# Altium schematic sheet TopSheet.SchDoc
size A4; CompanyName: Zohm Control GmbH; Address1: Rittersbacher Straße 48c; Address2: 91126 Schwabach; Address3: GERMANY; DocumentNumber: 3; SheetNumber: 3; SheetTotal: 6; Website: www.zohm-control.com
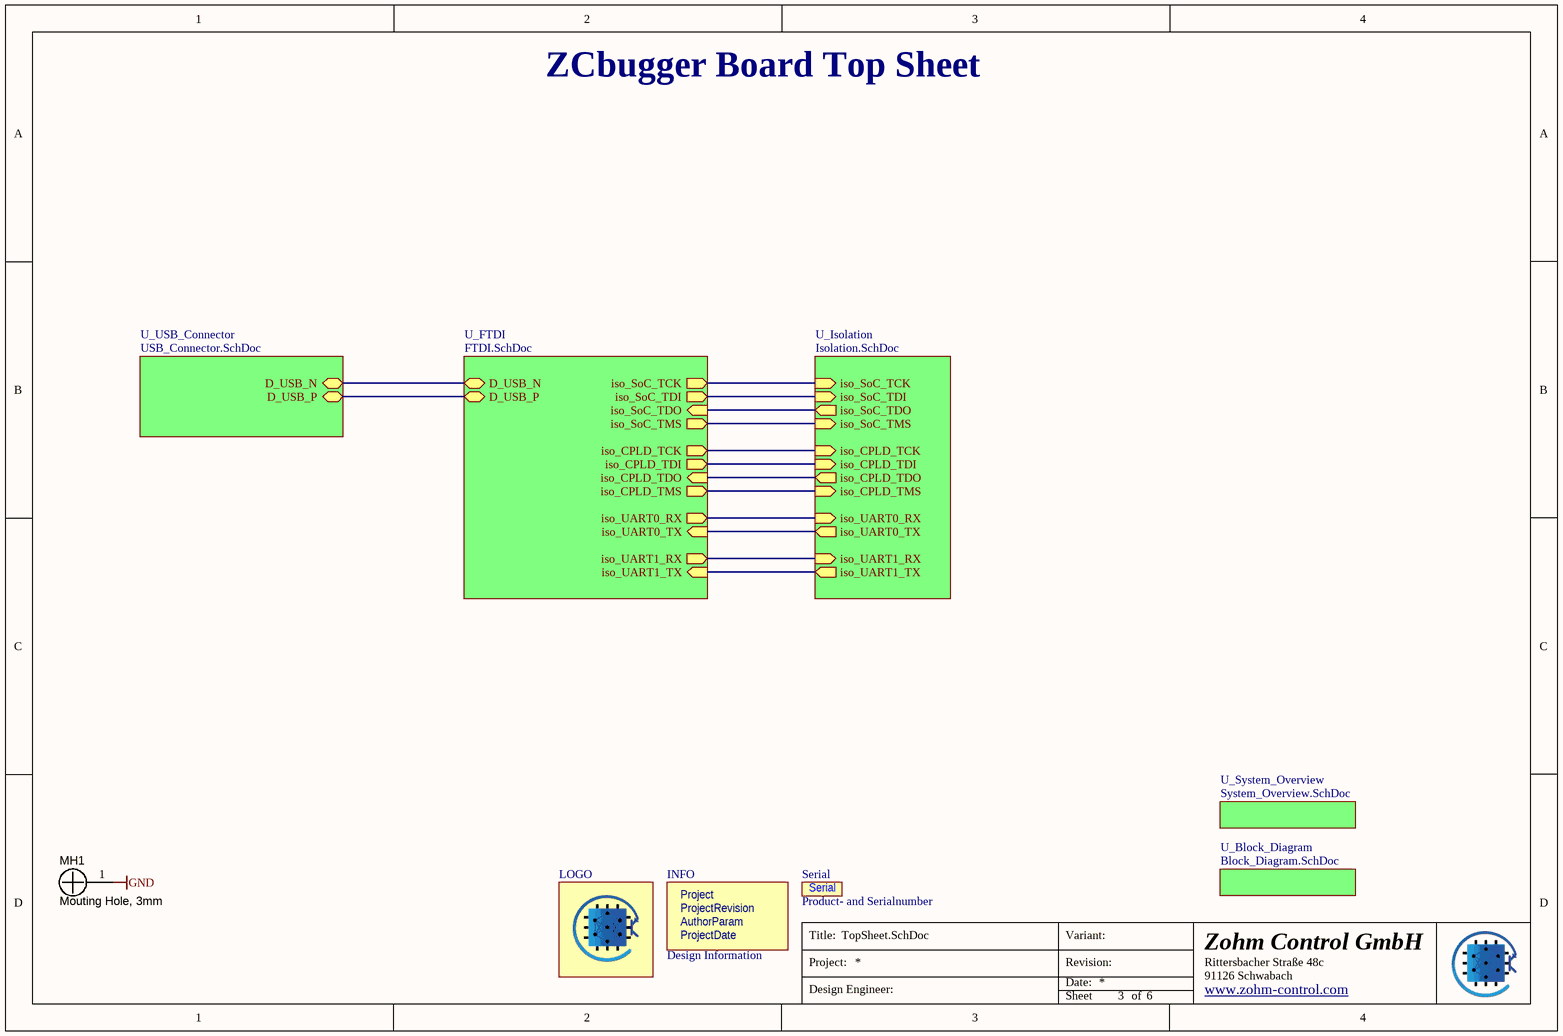
[diagram p0: TopSheet.SchDoc]

## Parts
INFO  Design Information  [Design_info]  (no BOM)
LOGO  ZC Logo  [ZC_Logo_FILLED_small]  (value not drawn)  (no BOM)
MH1  Mouting Hole, 3mm  [NY PMS 440 0025 PH]  (no BOM)
Serial  Product- and Serialnumber  [PN_and_SN]  (no BOM)

## Sub-sheets
U_Block_Diagram = Block_Diagram.SchDoc: no entries
U_FTDI = FTDI.SchDoc: D_USB_N (bidir), D_USB_P (bidir), iso_SoC_TCK (out), iso_SoC_TDI (out), iso_SoC_TDO (in), iso_SoC_TMS (out), iso_CPLD_TCK (out), iso_CPLD_TDI (out), iso_CPLD_TDO (in), iso_CPLD_TMS (out), iso_UART0_RX (out), iso_UART0_TX (in), iso_UART1_RX (out), iso_UART1_TX (in)
U_Isolation = Isolation.SchDoc: iso_SoC_TCK (in), iso_SoC_TDI (in), iso_SoC_TDO (out), iso_SoC_TMS (in), iso_CPLD_TCK (in), iso_CPLD_TDI (in), iso_CPLD_TDO (out), iso_CPLD_TMS (in), iso_UART0_RX (in), iso_UART0_TX (out), iso_UART1_RX (in), iso_UART1_TX (out)
U_System_Overview = System_Overview.SchDoc: no entries
U_USB_Connector = USB_Connector.SchDoc: D_USB_N (bidir), D_USB_P (bidir)

## Nets
GND: MH1.1
(unnamed): sheet U_FTDI/D_USB_N, sheet U_USB_Connector/D_USB_N
(unnamed): sheet U_FTDI/D_USB_P, sheet U_USB_Connector/D_USB_P
(unnamed): sheet U_FTDI/iso_SoC_TCK, sheet U_Isolation/iso_SoC_TCK
(unnamed): sheet U_FTDI/iso_SoC_TDI, sheet U_Isolation/iso_SoC_TDI
(unnamed): sheet U_FTDI/iso_SoC_TDO, sheet U_Isolation/iso_SoC_TDO
(unnamed): sheet U_FTDI/iso_SoC_TMS, sheet U_Isolation/iso_SoC_TMS
(unnamed): sheet U_FTDI/iso_CPLD_TCK, sheet U_Isolation/iso_CPLD_TCK
(unnamed): sheet U_FTDI/iso_CPLD_TDI, sheet U_Isolation/iso_CPLD_TDI
(unnamed): sheet U_FTDI/iso_CPLD_TDO, sheet U_Isolation/iso_CPLD_TDO
(unnamed): sheet U_FTDI/iso_CPLD_TMS, sheet U_Isolation/iso_CPLD_TMS
(unnamed): sheet U_FTDI/iso_UART0_RX, sheet U_Isolation/iso_UART0_RX
(unnamed): sheet U_FTDI/iso_UART0_TX, sheet U_Isolation/iso_UART0_TX
(unnamed): sheet U_FTDI/iso_UART1_RX, sheet U_Isolation/iso_UART1_RX
(unnamed): sheet U_FTDI/iso_UART1_TX, sheet U_Isolation/iso_UART1_TX

## Notes on the sheet
- ZCbugger Board Top Sheet
- Title:
- Project:
- Date:
- Revision:
- Variant:
- Design Engineer:
- Sheet
- of
- (in symbol Design_info) Project; ProjectRevision; AuthorParam; ProjectDate

## Library data of the parts
INFO = Design_info
LOGO = ZC_LOGO: Company Logo; Created: 2021_09_22_AGeiger; ComponentLink1Description: Homepage; ComponentLink1URL: www.zohm-control.com; Component Type: Logo
MH1 = NY PMS 440 0025 PH: Machine Screw, Round, #4-40 x 1/4, Nylon, Philips panhead; MF: B&F Fastener Supply; MPN: NY PMS 440 0025 PH; Package: Screw; ComponentLink1Description: Datasheet Link; ComponentLink1URL: http://www.fasnetdirect.com/refguide/Nylpanms.pdf; Created: 2021_06_22_AGeiger; Supplier 1: Digi-Key; Supplier Part Number 1: H542-ND; Value: Mouting Hole, 3mm
Serial = PCB_ZC_PN_and_SN: Created: 2024_01_06_AGeiger; Value: Product- and Serialnumber